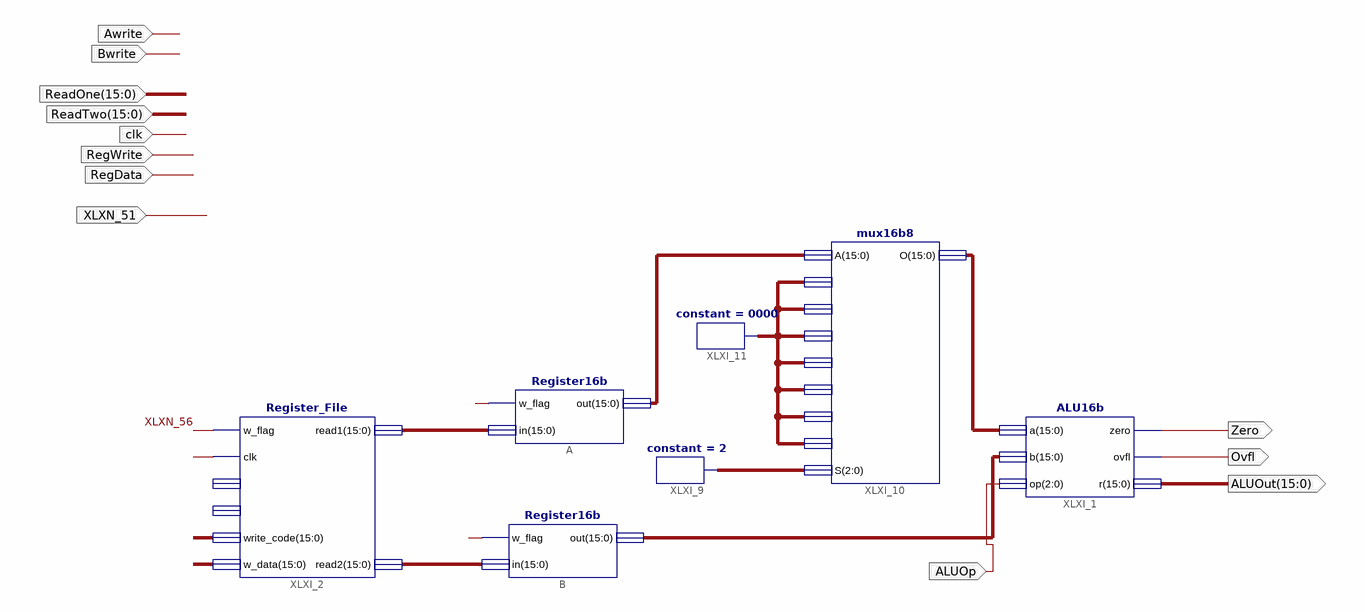
[diagram p0: schematic sheet 1]
// Xilinx ISE schematic Processor.sch (spartan3e) as structural Verilog: 7 symbols, 12 ports
module Processor (
  input  ALUOp,
  input  Awrite,
  input  Bwrite,
  input  [15:0] ReadOne,
  input  clk,
  input  [15:0] ReadTwo,
  input  RegWrite,
  input  RegData,
  input  XLXN_51,
  output Zero,
  output Ovfl,
  output [15:0] ALUOut
);

  wire XLXN_55, XLXN_56, XLXN_57, XLXN_58;
  wire [2:0] XLXN_33;
  wire [15:0] XLXN_1, XLXN_2, XLXN_6, XLXN_17, XLXN_18, XLXN_35, XLXN_53, XLXN_54;

  ALU16b XLXI_1 (.a(XLXN_18), .b(XLXN_17), .op({3{ALUOp}}), .zero(Zero), .ovfl(Ovfl), .r(ALUOut));
  Register_File XLXI_2 (
    .w_flag(XLXN_56), .clk(XLXN_55), .write_code(XLXN_54), .w_data(XLXN_53), .read1(XLXN_2), .read2(XLXN_1));  // open: reg1, reg2
  Register16b B (.w_flag(XLXN_58), .in(XLXN_1), .out(XLXN_17));
  Register16b A (.w_flag(XLXN_57), .in(XLXN_2), .out(XLXN_6));
  constant #(.CValue("2")) XLXI_9 (.O(XLXN_33));
  mux16b8 XLXI_10 (
    .A(XLXN_6), .B(XLXN_35), .C(XLXN_35), .D(XLXN_35), .E(XLXN_35), .F(XLXN_35), .G(XLXN_35), .H(XLXN_35),
    .S(XLXN_33), .O(XLXN_18));
  constant #(.CValue("0000")) XLXI_11 (.O(XLXN_35));
endmodule
